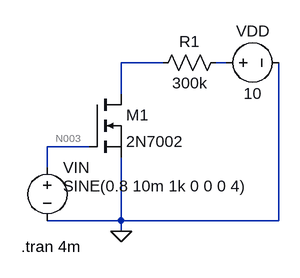
[diagram p0: schematic mosfet_amplifier.asc]
mosfet_amplifier.asc, the LTspice schematic file:
Version 4.1
SHEET 1 880 680
WIRE 240 64 176 64
WIRE 336 64 320 64
WIRE 176 112 176 64
WIRE 128 192 64 192
WIRE 64 224 64 192
WIRE 176 304 176 208
WIRE 176 304 64 304
WIRE 416 304 416 64
WIRE 416 304 176 304
WIRE 176 320 176 304
FLAG 176 320 0
SYMBOL nmos 128 112 R0
SYMATTR InstName M1
SYMATTR Value 2N7002
SYMBOL voltage 320 64 R270
WINDOW 0 32 56 VTop 2
WINDOW 3 -32 56 VBottom 2
SYMATTR InstName VDD
SYMATTR Value 10
SYMBOL res 336 48 R90
WINDOW 0 0 56 VBottom 2
WINDOW 3 32 56 VTop 2
SYMATTR InstName R1
SYMATTR Value 300k
SYMBOL voltage 64 208 R0
WINDOW 3 24 44 Left 2
WINDOW 123 0 0 Left 0
WINDOW 39 0 0 Left 0
SYMATTR Value SINE(0.8 10m 1k 0 0 0 4)
SYMATTR InstName VIN
TEXT 24 344 Left 2 !.tran 4m

The netlist it stands for:
* mosfet_amplifier.asc
M1 N001 N003 0 0 2N7002
VDD N002 0 10
R1 N002 N001 300k
VIN N003 0 SINE(0.8 10m 1k 0 0 0 4)
.model NMOS NMOS
.model PMOS PMOS
.lib standard.mos
.tran 4m
.backanno
.end

* Results of the author's LTspice run, read from the files saved beside the schematic
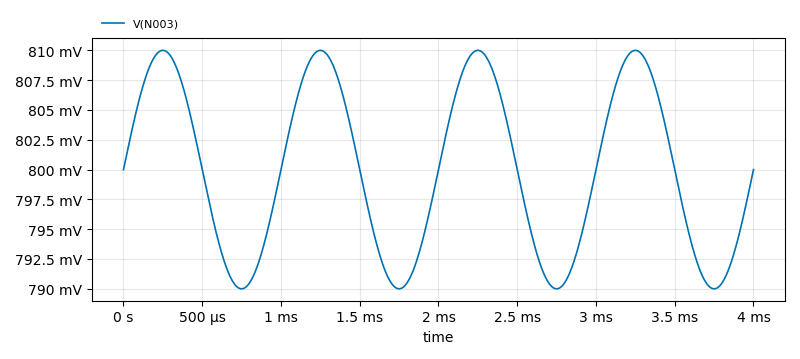
[diagram p1: Transient Analysis of mosfet_amplifier.asc, plotted from the saved traces]
* Transient Analysis, 1 run:
*   V(N003): min 790 mV, max 810 mV, average 800 mV, rms 800 mV, last 800 mV